# EAGLE design INA219_design_block_buildin (EAGLE 8.4.2)
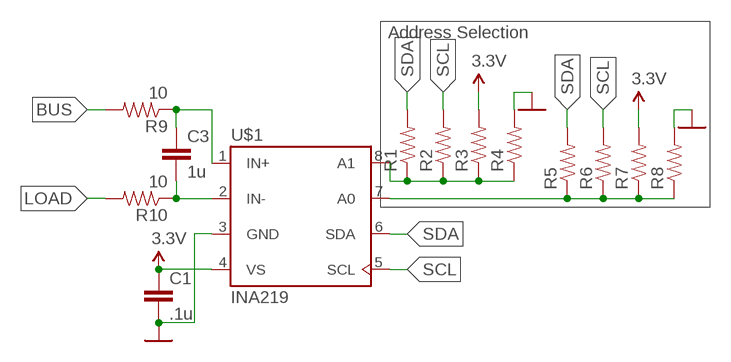
[diagram p0: schematic, sheet 1]

## Parts
C1  .1u  CAPACITOR0805  [0805]
C3  1u  CAPACITOR0805  [0805]
R1  RESISTOR0805  [0805]
R2  RESISTOR0805  [0805]
R3  RESISTOR0805  [0805]
R4  RESISTOR0805  [0805]
R5  RESISTOR0805  [0805]
R6  RESISTOR0805  [0805]
R7  RESISTOR0805  [0805]
R8  RESISTOR0805  [0805]
R9  10  RESISTOR0805  [0805]
R10  10  RESISTOR0805  [0805]
U$1  INA219  [SOT-23-8]

## Nets
3.3V: C1.1 R3.2 R7.2 U$1.4(VS)
BUS: R9.2
GND: C1.2 R4.2 R8.2 U$1.3(GND) ; supply symbol labelled DGND
INA219_A0: R5.1 R6.1 R7.1 R8.1 U$1.7(A0)
INA219_A1: R1.1 R2.1 R3.1 R4.1 U$1.8(A1)
INA219_IN+: C3.1 R9.1 U$1.1(IN+)
INA219_IN-: C3.2 R10.1 U$1.2(IN-)
LOAD: R10.2
SCL: R2.2 R6.2 U$1.5(SCL)
SDA: R1.2 R5.2 U$1.6(SDA)

## Notes on the sheet
- Address Selection

## Library data of the parts
C1 C3 = DubSat1 Components:CAPACITOR: Capacitor Standard 0603 ceramic capacitor, and 0.1" leaded capacitor.
R1-R10 = DubSat1 Components:RESISTOR: Resistor Basic schematic elements and footprints for 0603, 1206, and PTH resistors.
U$1 = DubSat1 Components:INA219

## Board
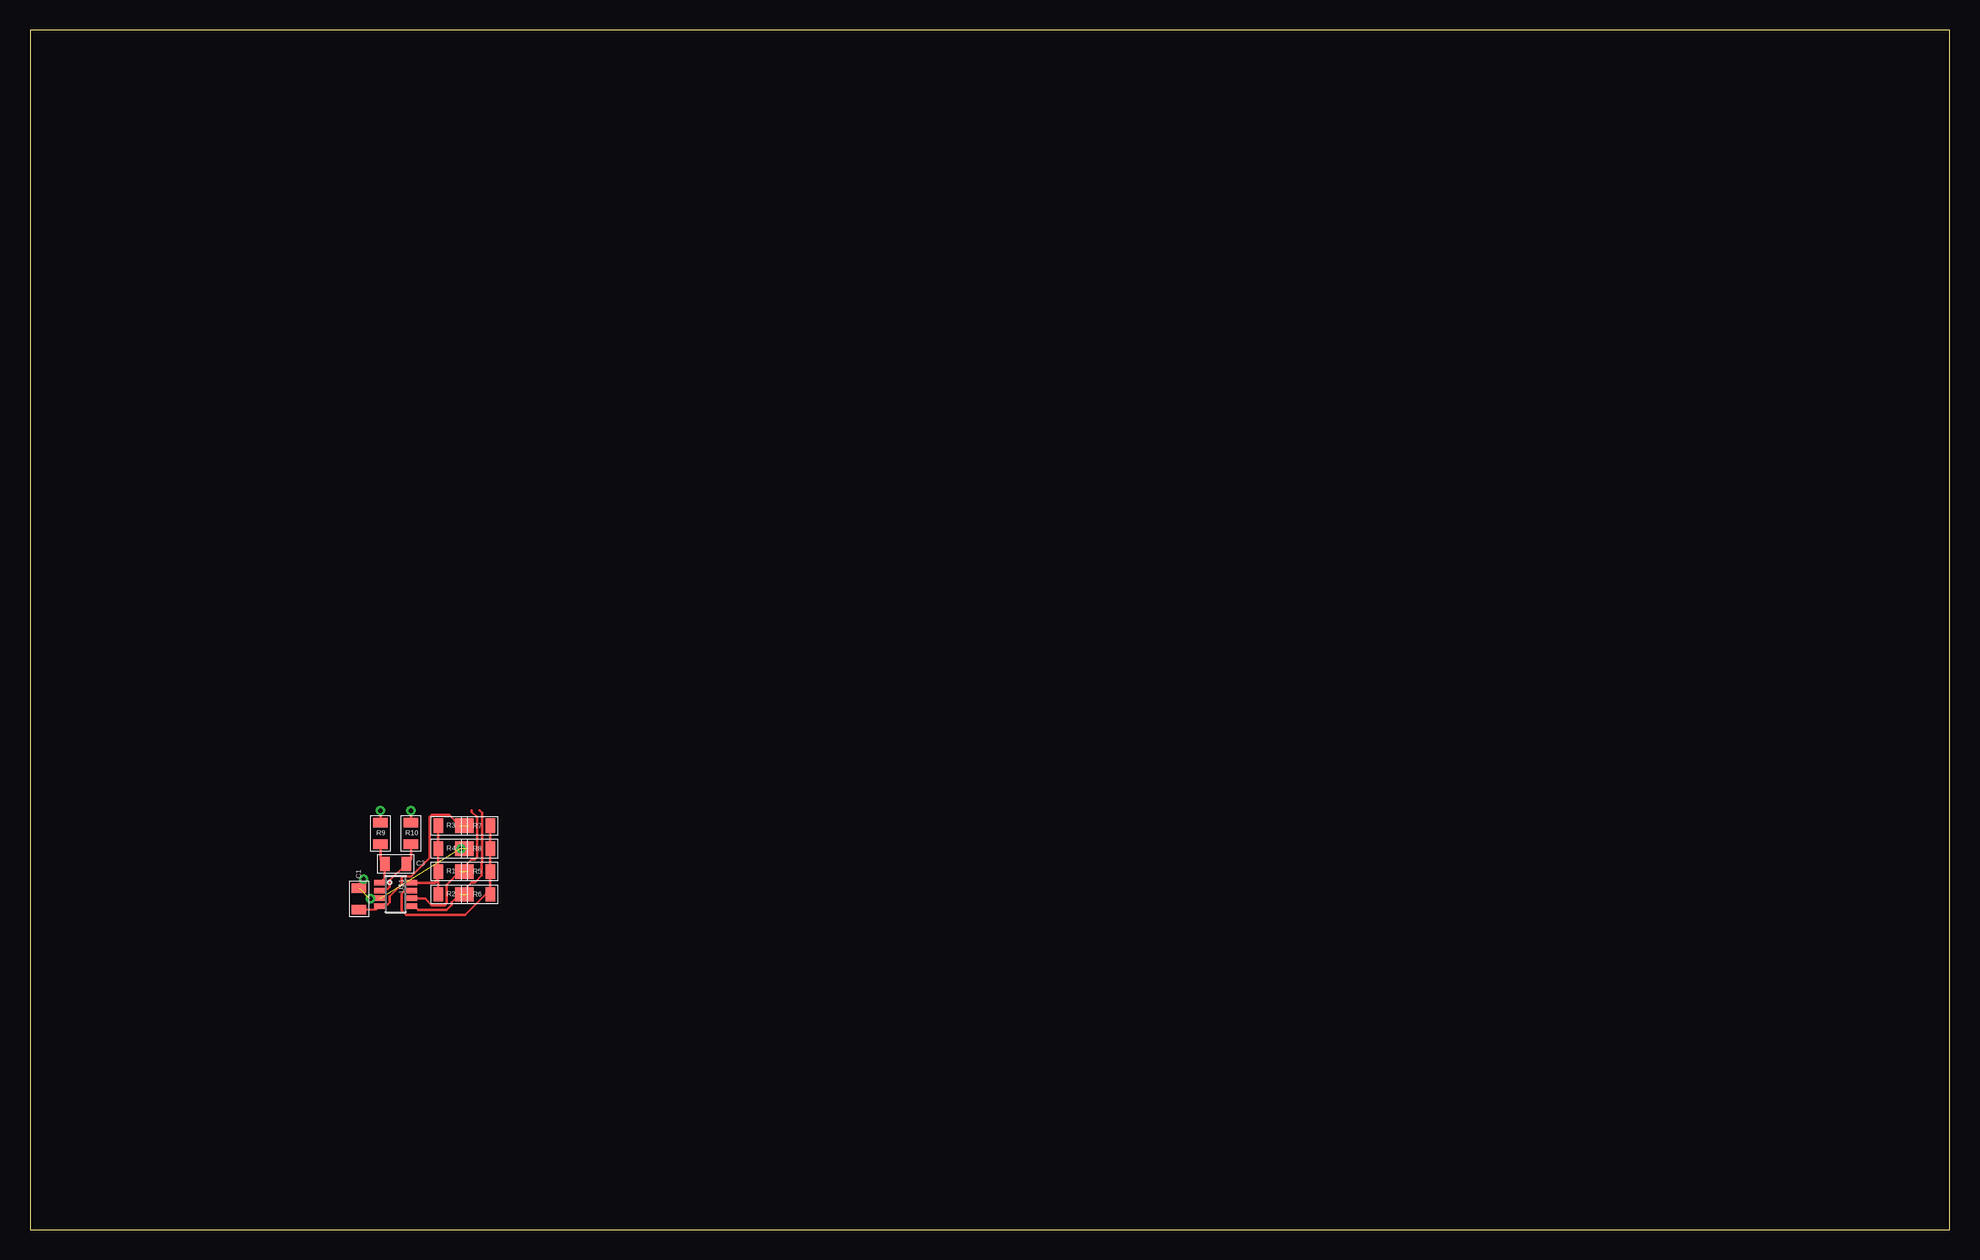
[diagram p1: board, top side]

Size 160 x 100 mm. Coordinates in mm from the lower left corner, seen from the top.
Outline: 0,0 160,0 160,100 0,100 0,0
Copper layers (1*16): Top 0.035mm / dielectric 1.5mm / Bottom 0.035mm
Design rules "default *": minimum track width 6mil, minimum drill 0.35mm, track to track 8mil, track to pad 8mil, pad to pad 8mil, via to via 8mil, smd to smd 6mil, copper to edge 40mil, drill to drill 6mil, minimum pad ring 10mil, minimum via ring 8mil, stop-mask expansion 4mil, vias tented up to drill 0mil, thermal gap 10mil

### Footprints (pad centres in the part's own frame; a part is rotated, then mirrored left to right if it is on the bottom)
0805 = smd 0.8 x 1.2: 1 -0.9,0; 2 0.9,0
SOT-23-8 = smd 0.45 x 1: 1 -0.975,-1.3; 2 -0.325,-1.3; 3 0.325,-1.3; 4 0.975,-1.3; 5 0.975,1.3; 6 0.325,1.3; 7 -0.325,1.3; 8 -0.975,1.3

### Placement (x,y rotation side)
C1  27.43,27.56 90 top
C3  30.48,30.48 0 top
R1  34.92,29.84 0 top
R2  34.92,27.94 0 top
R3  34.92,33.66 0 top
R4  34.92,31.75 0 top
R5  37.47,29.84 180 top
R6  37.47,27.94 180 top
R7  37.47,33.66 180 top
R8  37.47,31.75 180 top
R9  29.21,33.02 90 top
R10  31.75,33.02 90 top
U$1  30.48,27.94 270 top

### Tracks (layer width: path | path; a pad name or v marks a point on that pad's centre or on a via)
3.3V  (1 unrouted)
  Top 0.203: C1.1 28.8,26.69 U$1.4 29.3,27.09 29.81,27.09 29.98,27.26 29.98,27.77 30.98,28.76 30.98,29.27 31.15,29.45 31.78,29.45 33.32,30.99 33.32,34.38 33.5,34.56 34.92,34.56 R3.2
BUS  (via drill 0.35)
  Top 0.203: R9.2 v29.21,34.92
GND  (via drill 0.35)  (4 unrouted)
  Top 0.203: U$1.3 28.25,27.61 v28.37,27.58 | C1.2 27.43,28.83 v27.81,29.21
  other vias: 35.94,31.75
INA219_A0
  Top 0.203: U$1.7 31.66,28.14 31.15,28.14 30.98,27.97 30.98,26.61 31.37,26.22 36.28,26.22 38.37,28.31 | 38.37,28.31 R5.1 R8.1 R7.1 | 38.37,28.31 R6.1
INA219_A1
  Top 0.203: R3.1 R4.1 34.02,29.21 | 34.02,29.21 R2.1 34.02,29.21 | 34.02,29.21 R1.1 | U$1.8 33.73,28.91 34.02,29.21
INA219_IN+
  Top 0.203: U$1.1 29.58,29.32 C3.1 29.21,30.85 R9.1
INA219_IN-
  Top 0.203: 31.11,30.48 C3.2 | C3.2 31.75,30.85 R10.1 | C3.2 29.98,29.09 29.98,28.56 29.81,28.39 29.3,28.39 U$1.2
LOAD  (via drill 0.35)
  Top 0.203: R10.2 v31.75,34.92
SCL  (1 unrouted)
  Top 0.203: U$1.5 32.02,26.96 32.36,26.63 34.72,26.63 35.14,27.05 35.14,27.25 R2.2 36.83,28.94 37.09,28.94 37.66,29.51 37.66,30.57 37.68,30.59 37.68,34.71 37.47,34.92
SDA  (1 unrouted)
  Top 0.203: U$1.6 32.92,27.61 33.5,27.04 34.55,27.04 34.73,27.21 34.73,28.75 R1.2 36.83,30.84 37.09,30.84 37.27,31.02 37.27,34.38 36.83,34.82 36.83,34.92